# Altium schematic sheet mcu.SchDoc
size A4
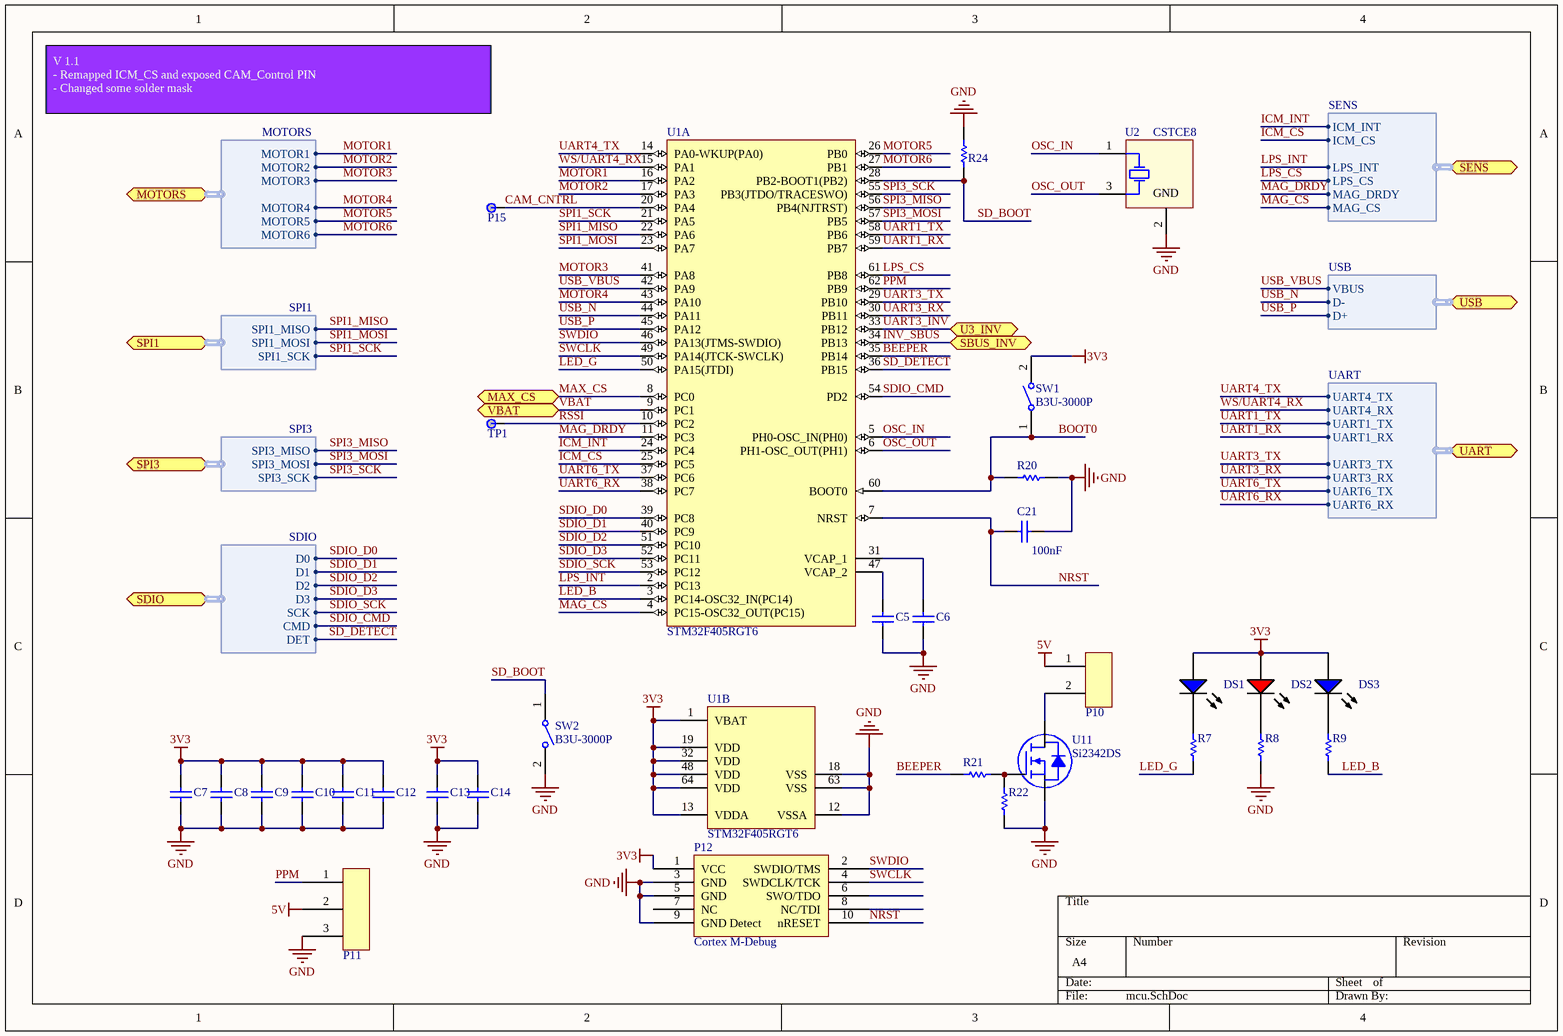
[diagram p0: mcu.SchDoc]

## Parts
C5  CAP 2.2uF 6.3V 0603(1608)  [CAPC0603(1608)100_L]  (value not drawn)
C6  CAP 2.2uF 6.3V 0603(1608)  [CAPC0603(1608)100_L]  (value not drawn)
C7  CAP 100nF 35V 0402(1005)  [CAPC0402(1005)60_L]  (value not drawn)
C8  CAP 100nF 35V 0402(1005)  [CAPC0402(1005)60_L]  (value not drawn)
C9  CAP 100nF 35V 0402(1005)  [CAPC0402(1005)60_L]  (value not drawn)
C10  CAP 100nF 35V 0402(1005)  [CAPC0402(1005)60_L]  (value not drawn)
C11  CAP 100nF 35V 0402(1005)  [CAPC0402(1005)60_L]  (value not drawn)
C12  CAP 4.7uF 6.3V 0603(1608)  [CAPC0603(1608)100_M]  (value not drawn)
C13  CAP 1uF 6.3V 0603(1608)  [CAPC0603(1608)100_N]  (value not drawn)
C14  CAP 10nF 35V 0402(1005)  [CAPC0402(1005)60_M]  (value not drawn)
C21  value 100nF  [CAPC0402(1005)60_L]  (hidden comment: CAP 100nF 35V 0402(1005))
DS1  TLMB1100-GS08  [VISH-TLMX1100-2_V]  (value not drawn)
DS2  TLMS1100-GS08  [VISH-TLMX1100_V]  (value not drawn)
DS3  TLMB1100-GS08  [VISH-TLMX1100-2_V]  (value not drawn)
P10  2 Pads  [2Pads]  (value not drawn)
P11  3 Pads  [3Pads]  (value not drawn)
P12  Cortex M-Debug  [FTSH-105-01-XXX-DV-K]
P15  1Pads  [1PADS]  (value not drawn)  (no BOM)
R7  1K 5% 0402(1005)  [RESC0402(1005)_L]  (value not drawn)
R8  1K 5% 0402(1005)  [RESC0402(1005)_L]  (value not drawn)
R9  1K 5% 0402(1005)  [RESC0402(1005)_L]  (value not drawn)
R20  100K 5% 0402(1005)  [RESC0402(1005)_L]  (value not drawn)
R21  200R 5% 0402(1005)  [RESC0402(1005)_N]  (value not drawn)
R22  110K 5% 0402(1005)  [RESC0402(1005)_L]  (value not drawn)
R24  47K 5% 0402(1005)  [RESC0402(1005)_M]  (value not drawn)
SW1  B3U-3000P  [OMRON-B3U-3000P_V]
SW2  B3U-3000P  [OMRON-B3U-3000P_V]
TP1  Test Point  [TP]  (value not drawn)
U1  STM32F405RGT6  [STM-LQFP64_M]  (parts A,B of 2)
U2  CSTCE8  [MURA-CSTCE_V-3_V]
U11  Si2342DS  [SOT23-3]

## Ports
MAX_CS, MOTORS (harness MOTORS), SBUS_INV, SDIO (harness SDIO), SENS (harness SENS), SPI1 (harness SPI1), SPI3 (harness SPI3), U3_INV, UART (harness UART), USB (harness USB), VBAT

## Harnesses
MOTORS: MOTOR1, MOTOR2, MOTOR3, MOTOR4, MOTOR5, MOTOR6
SPI1: SPI1_MISO, SPI1_MOSI, SPI1_SCK
SPI3: SPI3_MISO, SPI3_MOSI, SPI3_SCK
SDIO: D0, D1, D2, D3, SCK, CMD, DET
USB: VBUS, D-, D+
UART: UART4_TX, UART4_RX, UART1_TX, UART1_RX, UART3_TX, UART3_RX, UART6_TX, UART6_RX
SENS: ICM_INT, ICM_CS, LPS_INT, LPS_CS, MAG_DRDY, MAG_CS

## Nets
3V3: C7.2 C8.2 C9.2 C10.2 C11.2 C12.2 C13.2 C14.2 DS1.1(A) DS2.1(A) DS3.1(A) P12.1(VCC) SW1.2 U1.1(VBAT) U1.13(VDDA) U1.19(VDD) U1.32(VDD) U1.48(VDD) U1.64(VDD)
5V: P10.1 P11.2
GND: C5.1 C6.1 C7.1 C8.1 C9.1 C10.1 C11.1 C12.1 C13.1 C14.1 C21.1 P11.3 P12.3(GND) P12.5(GND) P12.9(GND_Detect) R8.1 R20.2 R22.1 R24.2 SW2.2 U1.12(VSSA) U1.18(VSS) U1.63(VSS) U2.2(GND) U11.2(S)
BEEPER: R21.1 U1.35(PB14)
BOOT0: R20.1 SW1.1 U1.60(BOOT0)
CAM_CNTRL: P15.1 U1.20(PA4)
ICM_CS: U1.25(PC5) ; port SENS.ICM_CS
ICM_INT: U1.24(PC4) ; port SENS.ICM_INT
INV_SBUS: U1.34(PB13) ; port SBUS_INV
LED_B: R9.1 U1.3(PC14-OSC32_IN(PC14))
LED_G: R7.1 U1.50(PA15(JTDI))
LPS_CS: U1.61(PB8) ; port SENS.LPS_CS
LPS_INT: U1.2(PC13) ; port SENS.LPS_INT
MAG_CS: U1.4(PC15-OSC32_OUT(PC15)) ; port SENS.MAG_CS
MAG_DRDY: U1.11(PC3) ; port SENS.MAG_DRDY
MAX_CS: U1.8(PC0) ; port MAX_CS
MOTOR1: U1.16(PA2) ; port MOTORS.MOTOR1
MOTOR2: U1.17(PA3) ; port MOTORS.MOTOR2
MOTOR3: U1.41(PA8) ; port MOTORS.MOTOR3
MOTOR4: U1.43(PA10) ; port MOTORS.MOTOR4
MOTOR5: U1.26(PB0) ; port MOTORS.MOTOR5
MOTOR6: U1.27(PB1) ; port MOTORS.MOTOR6
NRST: C21.2 P12.10(nRESET) U1.7(NRST)
OSC_IN: U1.5(PH0-OSC_IN(PH0)) U2.1(C1)
OSC_OUT: U1.6(PH1-OSC_OUT(PH1)) U2.3(C2)
PPM: P11.1 U1.62(PB9)
RSSI: TP1.1 U1.10(PC2)
SD_BOOT: R24.1 SW2.1 U1.28(PB2-BOOT1(PB2))
SD_DETECT: U1.36(PB15) ; port SDIO.DET
SDIO_CMD: U1.54(PD2) ; port SDIO.CMD
SDIO_D0: U1.39(PC8) ; port SDIO.D0
SDIO_D1: U1.40(PC9) ; port SDIO.D1
SDIO_D2: U1.51(PC10) ; port SDIO.D2
SDIO_D3: U1.52(PC11) ; port SDIO.D3
SDIO_SCK: U1.53(PC12) ; port SDIO.SCK
SPI1_MISO: U1.22(PA6) ; port SPI1.SPI1_MISO
SPI1_MOSI: U1.23(PA7) ; port SPI1.SPI1_MOSI
SPI1_SCK: U1.21(PA5) ; port SPI1.SPI1_SCK
SPI3_MISO: U1.56(PB4(NJTRST)) ; port SPI3.SPI3_MISO
SPI3_MOSI: U1.57(PB5) ; port SPI3.SPI3_MOSI
SPI3_SCK: U1.55(PB3(JTDO/TRACESWO)) ; port SPI3.SPI3_SCK
SWCLK: P12.4(SWDCLK/TCK) U1.49(PA14(JTCK-SWCLK))
SWDIO: P12.2(SWDIO/TMS) U1.46(PA13(JTMS-SWDIO))
UART1_RX: U1.59(PB7) ; port UART.UART1_RX
UART1_TX: U1.58(PB6) ; port UART.UART1_TX
UART3_INV: U1.33(PB12) ; port U3_INV
UART3_RX: U1.30(PB11) ; port UART.UART3_RX
UART3_TX: U1.29(PB10) ; port UART.UART3_TX
UART4_TX: U1.14(PA0-WKUP(PA0)) ; port UART.UART4_TX
UART6_RX: U1.38(PC7) ; port UART.UART6_RX
UART6_TX: U1.37(PC6) ; port UART.UART6_TX
USB_N: U1.44(PA11) ; port USB.D-
USB_P: U1.45(PA12) ; port USB.D+
USB_VBUS: U1.42(PA9) ; port USB.VBUS
VBAT: U1.9(PC1) ; port VBAT
WS/UART4_RX: U1.15(PA1) ; port UART.UART4_RX
NetC5_2: C5.2 U1.47(VCAP_2)
NetC6_2: C6.2 U1.31(VCAP_1)
NetDS1_2: DS1.2(K) R7.2
NetDS2_2: DS2.2(K) R8.2
NetDS3_2: DS3.2(K) R9.2
NetP10_2: P10.2 U11.3(D)
NetR21_2: R21.2 R22.2 U11.1(G)

Not connected (* = marked no-connect by the designer): P12 6(SWO/TDO) 7(NC) 8(NC/TDI)

## Notes on the sheet
- V 1.1
  - Remapped ICM_CS and exposed CAM_Control PIN
  - Changed some solder mask

## Library data of the parts
C5 C6 = CMP-1035-02754-1: CAP 2.2uF 6.3V ±10% 0603 (1608 Metric) Thickness 1mm SMD; Case-EIA: 0603; Tolerance: Â±10%; Case-Metric: 1608; Technology: SMT; Value: 2.2uF; Rated Voltage: 6.3 V; Max Thickness: 1 mm
C7-C11 C21 = CMP-1034-02075-1: CAP 100nF 35V ±10% 0402 (1005 Metric) Thickness 0.6mm SMD; Case-Metric: 1005; Case-EIA: 0402; Tolerance: Â±10%; Max Thickness: 0.6 mm; Technology: SMT; Rated Voltage: 35 V
  C7-C11: Value: 100nF
C12 = CMP-1035-02780-1: CAP 4.7uF 6.3V ±10% 0603 (1608 Metric) Thickness 1mm SMD; Case-Metric: 1608; Case-EIA: 0603; Tolerance: Â±10%; Technology: SMT; Value: 4.7uF; Max Thickness: 1 mm; Rated Voltage: 6.3 V
C13 = CMP-1035-02730-1: CAP 1uF 6.3V ±10% 0603 (1608 Metric) Thickness 1mm SMD; Case-EIA: 0603; Case-Metric: 1608; Tolerance: Â±10%; Rated Voltage: 6.3 V; Max Thickness: 1 mm; Technology: SMT; Value: 1uF
C14 = CMP-1034-01883-1: CAP 10nF 35V ±10% 0402 (1005 Metric) Thickness 0.6mm SMD; Tolerance: Â±10%; Case-Metric: 1005; Case-EIA: 0402; Rated Voltage: 35 V; Technology: SMT; Value: 10nF; Max Thickness: 0.6 mm
DS1 DS3 = CMP-1666-00028-1: Blue LED, 10 mA, 3.9 V, -40 to 100 degC, 2-Pin SMD (0603), RoHS, Tape and Reel; Tolerance: 10%; Voltage Rating: 100 V; Capacitance: 10 nF; Type (Capacitors): X7R; Case\Package: Radial; ComponentLink1Description: Manufacturer URL; REACH SVHC: No SVHC; Package Quantity: 500; PackageDescription: 2-Pin Surface Mount Device, Body 1.6 x 0.8 mm; Pins: 2; ComponentLink2URL: http://download.siliconexpert.com/pdfs/2016/8/7/12/43/26/667/vsh_/manual/379263299541529tlmb1100.pdf; RoHSCompliant: true; Lead Pitch: 2.54 mm; Height: 2.54 mm; DatasheetVersion: Rev. 2.7, 03/2016; Length: 5.33 mm; ComponentLink1URL: http://www.vishay.com/; Min Operating Temperature: -55 degC; PackageReference: 0603; Packaging: Bulk; ComponentLink2Description: Datasheet; Max Operating Temperature: 125 degC; Radiation Hardening: No; Width: 3.81 mm; Mount: Through Hole
DS2 = CMP-1666-00027-1: LED, RED, 2.1 V, -40 to 100 degC, 2-Pin SMD (0603), RoHS, Tape and Reel; Type (Capacitors): C0G; Resistance: 100000000000 Ohm; Capacitance: 12 pF; Voltage Rating: 50 V; Tolerance: 5%; Min Operating Temperature: -55degC; REACH SVHC: No SVHC; ComponentLink2Description: Datasheet; ComponentLink1URL: http://www.vishay.com/; Width: 0.8 mm; Package Quantity: 4000; PackageReference: TLMX1100; ComponentLink2URL: http://www.vishay.com/docs/83173/tlmb1100.pdf; Case/Package: 0603; Case Code (Metric): 1608; Packaging: Tape and Reel; Pins: 2; ComponentLink1Description: Manufacturer URL; Max Operating Temperature: 125degC; Height: 0.8 mm; Length: 1.6 mm; Mount: Surface Mount; PackageDescription: 2-Pin Surface Mount Device, Body 1.6 x 0.8 mm; DatasheetVersion: Rev. 2.7, 03/2016; Case Code (Imperial): 0603; Voltage Rating (DC): 50 V; RoHSCompliant: True; Radiation Hardening: No
P12 = Cortex M Debug: Cortex M-Debug Connector
P15 = Test Point_1: Pad
R7-R9 = CMP-1011-00074-1: 1K 0.063W 5% 0402 (1005 Metric)  SMD; Value: 1000.00 Ohm; Case-EIA: 0402; Case-Metric: 1005; Tolerance: 5 %; Power: 0.063 W; Technology: SMT
R20 = CMP-1011-00122-1: 100K 0.063W 5% 0402 (1005 Metric)  SMD; Value: 100000.00 Ohm; Case-EIA: 0402; Case-Metric: 1005; Power: 0.063 W; Technology: SMT; Tolerance: 5 %
R21 = CMP-1011-00057-1: 200R 0.063W 5% 0402 (1005 Metric)  SMD; Value: 200.00 Ohm; Case-Metric: 1005; Case-EIA: 0402; Power: 0.063 W; Technology: SMT; Tolerance: 5 %
R22 = CMP-1011-00123-1: 110K 0.063W 5% 0402 (1005 Metric)  SMD; Case-Metric: 1005; Value: 110000.00 Ohm; Case-EIA: 0402; Technology: SMT; Tolerance: 5 %; Power: 0.063 W
R24 = CMP-1011-00114-1: 47K 0.063W 5% 0402 (1005 Metric)  SMD; Case-EIA: 0402; Case-Metric: 1005; Value: 47000.00 Ohm; Tolerance: 5 %; Technology: SMT; Power: 0.063 W
SW1 SW2 = CMP-1677-00003-1: Ultra-Small Tactile Switch, 1 to 50 mA, 3 to 12 V, -25 to 70 degC, 2-Pin SMD, RoHS, Tape and Reel; Tolerance: 20%; Voltage Rating (DC): 50 V; Capacitance: 470 uF; Case\Package: Radial; PackageReference: B3U-3000P; Min Operating Temperature: -40 degC; Length: 20 mm; Mount: Through Hole; ComponentLink2Description: Datasheet; RoHSCompliant: true; ComponentLink1URL: http://www.omron.com/; Package Quantity: 200; Radiation Hardening: No; Height: 20 mm; ComponentLink2URL: https://www.omron.com/ecb/products/pdf/en-b3u.pdf; Diameter: 10 mm; Max Operating Temperature: 85 degC; Lead Pitch: 5 mm; DatasheetVersion: Jan-15; Packaging: Bulk; PackageDescription: 2-Pin Surface Mount Device, Body 4 x 3.2 mm; Voltage Rating: 50 V; Pins: 2; ComponentLink1Description: Manufacturer URL; REACH SVHC: No SVHC
U1 = CMP-0243-00019-3: ARM Cortex-M4 32-bit MCU+FPU, 210 DMIPS, 1024 kB Flash, 192 kB Internal RAM, 51 I/Os, 64-pin LQFP, -40 to 85 degC, Tray; Manufacturer: STMicroelectronics; Supply Voltage(Vcc) min (V): 1.8; Supply Voltage(Vcc) max (V): 3.6; Internal RAM Size (kB): 192; I/Os (High Current): 51; D/A Converter: 2x12-bit; FLASH Size (Prog) (kB): 1024; Operating Frequency(F) (Processor speed) (MHz): 168; ComponentLink2Description: Datasheet; PackageVersion: Rev. 4, 06/2013; DatasheetVersion: Rev. 4; Core: ARM Cortex-M4; ComponentLink2URL: http://www.st.com/st-web-ui/static/active/en/resource/technical/document/datasheet/DM00037051.pdf; PackageReference: LQFP64; Packing: Tray; ComponentLink1Description: Manufacturer URL; ComponentLink3URL: http://www.st.com/st-web-ui/static/active/en/resource/technical/document/datasheet/DM00037051.pdf; ComponentLink3Description: Package Specification; Mounting Technology: Surface Mount; ComponentLink1URL: http://www.st.com/web/en/home.html; PackageDescription: 64-Pin Low Profile Quad Flat Package, 10 x 10 mm Body, 0.5 mm Pitch; PartNumber: STM32F405RGT6
U2 = CMP-0588-00001-2: Ceramic Resonator, 16 MHz with Built-in Capacitance, Thickness Expander Mode, Initial Frequency Tolerance +/- 0.5%, Load Capacity 15 pF, -20 to 80 degC, 3.2 x 1.3 x 1 mm SMD, RoHS, Reel; Manufacturer: Murata; Oscillating Frequency: 16 MHz; Load Capacity: 15 pF; PackageDescription: 3-Pin SMD, Body 3.2 x 1.3 mm, Pitch 0.95 mm; Mounting Technology: Surface Mount; ComponentLink1URL: http://www.murata.com/; RoHS: TRUE; Packing: Reel; Initial Frequency Tolerance: +/- 0.5%; PartNumber: CSTCE8; ComponentLink2Description: Datasheet; DatasheetVersion: Rev. P16E-22; PackageReference: CSTCE_V-3; Operating Temperature Range: -20 to 80 degC; ComponentLink2URL: http://www.murata.com/products/catalog/pdf/p16e.pdf; ComponentLink1Description: Manufacturer URL; Initial Tolerance: +/- 0.5%
U11 = Si2342DS: N Channel MOSFET